# Altium schematic sheet Backup Power.SchDoc
size A; DocumentNumber: 13; SheetNumber: 13; SheetTotal: 16
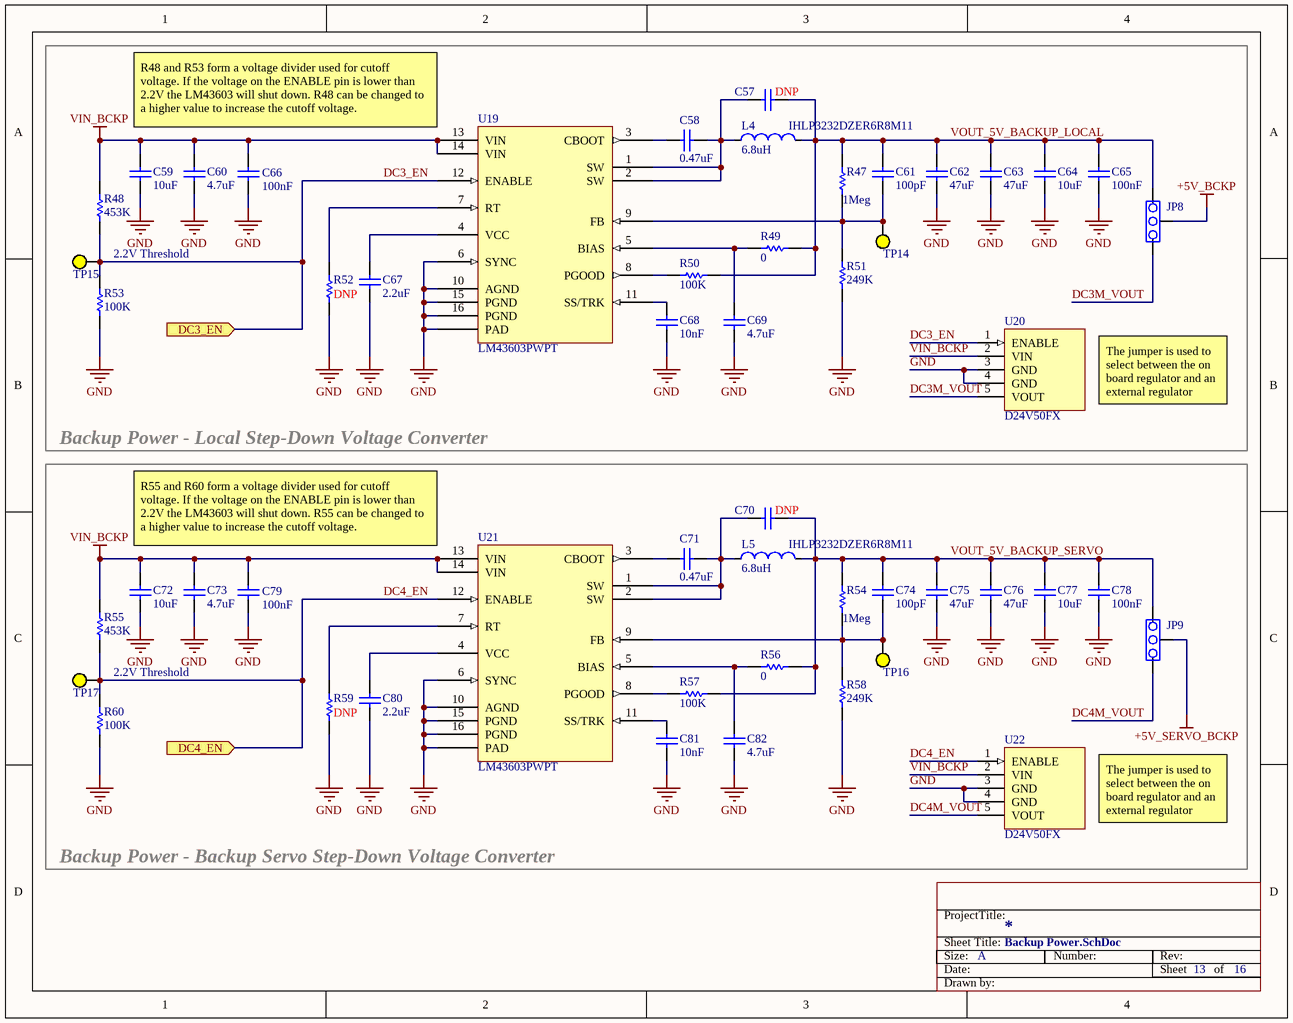
[diagram p0: Backup Power.SchDoc]

## Parts
C57  Note: DNP  [CAP_0402[1005M]]  (hidden comment: Cap)
C58  value 0.47uF  [CAP_0402[1005M]]  (hidden comment: Cap)
C59  value 10uF  [CAP_1210[3225M]]  (hidden comment: Cap)
C60  value 4.7uF  [CAP_1210[3225M]]  (hidden comment: Cap)
C61  value 100pF  [CAP_0402[1005M]]  (hidden comment: Cap)
C62  value 47uF  [CAP_1210[3225M]]  (hidden comment: Cap)
C63  value 47uF  [CAP_1210[3225M]]  (hidden comment: Cap)
C64  value 10uF  [CAP_0805[2012M]]  (hidden comment: Cap)
C65  value 100nF  [CAP_0603[1608M]]  (hidden comment: Cap)
C66  value 100nF  [CAP_0402[1005M]]  (hidden comment: Cap)
C67  value 2.2uF  [CAP_0402[1005M]]  (hidden comment: CAP)
C68  value 10nF  [CAP_0402[1005M]]  (hidden comment: Cap)
C69  value 4.7uF  [CAP_0402[1005M]]  (hidden comment: Cap)
C70  Note: DNP  [CAP_0402[1005M]]  (hidden comment: Cap)
C71  value 0.47uF  [CAP_0402[1005M]]  (hidden comment: Cap)
C72  value 10uF  [CAP_1210[3225M]]  (hidden comment: Cap)
C73  value 4.7uF  [CAP_1210[3225M]]  (hidden comment: Cap)
C74  value 100pF  [CAP_0402[1005M]]  (hidden comment: Cap)
C75  value 47uF  [CAP_1210[3225M]]  (hidden comment: Cap)
C76  value 47uF  [CAP_1210[3225M]]  (hidden comment: Cap)
C77  value 10uF  [CAP_0805[2012M]]  (hidden comment: Cap)
C78  value 100nF  [CAP_0603[1608M]]  (hidden comment: Cap)
C79  value 100nF  [CAP_0402[1005M]]  (hidden comment: Cap)
C80  value 2.2uF  [CAP_0402[1005M]]  (hidden comment: CAP)
C81  value 10nF  [CAP_0402[1005M]]  (hidden comment: Cap)
C82  value 4.7uF  [CAP_0402[1005M]]  (hidden comment: Cap)
JP8  Jumper  [JUMPER_3POS]  (value not drawn)  (no BOM)
JP9  Jumper  [JUMPER_3POS]  (value not drawn)  (no BOM)
L4  6.8uH  Manufacturer Part Number: IHLP3232DZER6R8M11  [IHLP-3232DZ]
L5  6.8uH  Manufacturer Part Number: IHLP3232DZER6R8M11  [IHLP-3232DZ]
R47  value 1Meg  [RES_0402[1005M]]  (hidden comment: RES)
R48  value 453K  [RES_0603[1608M]]  (hidden comment: RES)
R49  value 0  [JUMPER_RES_0402]  (hidden comment: RES)
R50  value 100K  [RES_0402[1005M]]  (hidden comment: RES)
R51  value 249K  [RES_0402[1005M]]  (hidden comment: RES)
R52  Note: DNP  [RES_0402[1005M]]  (hidden comment: RES)
R53  value 100K  [RES_0603[1608M]]  (hidden comment: RES)
R54  value 1Meg  [RES_0402[1005M]]  (hidden comment: RES)
R55  value 453K  [RES_0603[1608M]]  (hidden comment: RES)
R56  value 0  [JUMPER_RES_0402]  (hidden comment: RES)
R57  value 100K  [RES_0402[1005M]]  (hidden comment: RES)
R58  value 249K  [RES_0402[1005M]]  (hidden comment: RES)
R59  Note: DNP  [RES_0402[1005M]]  (hidden comment: RES)
R60  value 100K  [RES_0603[1608M]]  (hidden comment: RES)
TP14  Test Point SIG  [TP_SMD_1_SILK]  (value not drawn)  (no BOM)
TP15  Test Point SIG  [TP_TH_1_SILK]  (value not drawn)  (no BOM)
TP16  Test Point SIG  [TP_SMD_1_SILK]  (value not drawn)  (no BOM)
TP17  Test Point SIG  [TP_TH_1_SILK]  (value not drawn)  (no BOM)
U19  LM43603PWPT  [HTSSOP-16]
U20  Manufacturer Part Number: D24V50FX  [D24V__F_]  (hidden comment: D24V__F_)
U21  LM43603PWPT  [HTSSOP-16]
U22  Manufacturer Part Number: D24V50FX  [D24V__F_]  (hidden comment: D24V__F_)

## Blocks framed on the sheet
Backup Power - Local Step-Down Voltage Converter: C57-C69 JP8 L4 R47-R53 TP14 TP15 U19 U20
Backup Power - Backup Servo Step-Down Voltage Converter: C70-C82 JP9 L5 R54-R60 TP16 TP17 U21 U22

## Ports
DC3_EN (in), DC4_EN (in)

## Nets
+5V_BCKP: JP8.2
+5V_SERVO_BCKP: JP9.2
GND: C59.2 C60.2 C62.2 C63.2 C64.2 C65.2 C66.2 C67.1 C68.2 C69.2 C72.2 C73.2 C75.2 C76.2 C77.2 C78.2 C79.2 C80.1 C81.2 C82.2 R51.2 R52.1 R53.1 R58.2 R59.1 R60.1 U19.6(SYNC) U19.10(AGND) U19.15(PGND) U19.16(PGND) U19.EP(PAD) U20.3(GND) U20.4(GND) U21.6(SYNC) U21.10(AGND) U21.15(PGND) U21.16(PGND) U21.EP(PAD) U22.3(GND) U22.4(GND)
VIN_BCKP: C59.1 C60.1 C66.1 C72.1 C73.1 C79.1 R48.2 R55.2 U19.13(VIN) U19.14(VIN) U20.2(VIN) U21.13(VIN) U21.14(VIN) U22.2(VIN)
DC3_EN: R48.1 R53.2 TP15.1 U19.12(ENABLE) U20.1(ENABLE) ; port DC3_EN
DC3M_VOUT: JP8.3 U20.5(VOUT)
DC4_EN: R55.1 R60.2 TP17.1 U21.12(ENABLE) U22.1(ENABLE) ; port DC4_EN
DC4M_VOUT: JP9.3 U22.5(VOUT)
VOUT_5V_BACKUP_LOCAL: C57.2 C61.1 C62.1 C63.1 C64.1 C65.1 JP8.1 L4.2 R47.1 R49.1 R50.1
VOUT_5V_BACKUP_SERVO: C70.2 C74.1 C75.1 C76.1 C77.1 C78.1 JP9.1 L5.2 R54.1 R56.1 R57.1
NetC57_1: C57.1 C58.2 L4.1 U19.1(SW) U19.2(SW)
NetC58_1: C58.1 U19.3(CBOOT)
NetC61_2: C61.2 R47.2 R51.1 TP14.1 U19.9(FB)
NetC67_2: C67.2 U19.4(VCC)
NetC68_1: C68.1 U19.11(SS/TRK)
NetC69_1: C69.1 R49.2 U19.5(BIAS)
NetC70_1: C70.1 C71.2 L5.1 U21.1(SW) U21.2(SW)
NetC71_1: C71.1 U21.3(CBOOT)
NetC74_2: C74.2 R54.2 R58.1 TP16.1 U21.9(FB)
NetC80_2: C80.2 U21.4(VCC)
NetC81_1: C81.1 U21.11(SS/TRK)
NetC82_1: C82.1 R56.2 U21.5(BIAS)
NetR50_2: R50.2 U19.8(PGOOD)
NetR52_2: R52.2 U19.7(RT)
NetR57_2: R57.2 U21.8(PGOOD)
NetR59_2: R59.2 U21.7(RT)

## Notes on the sheet
- R48 and R53 form a voltage divider used for cutoff voltage. If the voltage on the ENABLE pin is lower than 2.2V the LM43603 will shut down. R48 can be changed to a higher value to increase the cutoff voltage.
- 2.2V Threshold
- The jumper is used to select between the on board regulator and an external regulator
- R55 and R60 form a voltage divider used for cutoff voltage. If the voltage on the ENABLE pin is lower than 2.2V the LM43603 will shut down. R55 can be changed to a higher value to increase the cutoff voltage.
- Sheet Title:
- ProjectTitle:
- Size:
- Date:
- A
- Number:
- Rev:
- Sheet         of
- Drawn by:

## Library data of the parts
C57 C70 = Cap: Capacitor
C58 C71 = Cap: CAP CER 0.1UF 10V 10% X7R 0402; Manufacturer Part Number: CC0402ZRY5V7BB474; Manufacturer: Yageo; Supplier 1: Digi-Key; Supplier Part Number 1: 311-1735-1-ND; ComponentLink1URL: http://www.yageo.com/documents/recent/UPY-GPHC_Y5V_6.3V-to-50V_5_revised.pdf; ComponentLink1Description: Datasheet
C59 C72 = Cap: Capacitor; Manufacturer Part Number: CL32B106KBJNNNE; Manufacturer: Samsung Electro-Mechanics America, Inc.; Supplier 1: Digi-Key; Supplier Part Number 1: 1276-3387-1-ND; ComponentLink1URL: http://www.samsungsem.com/global/support/library/product-catalog/__icsFiles/afieldfile/2014/11/13/MLCC.pdf; ComponentLink1Description: Datasheet
C60 C73 = Cap: Capacitor; Manufacturer Part Number: CL32B475KBUYNNE; Manufacturer: Samsung Electro-Mechanics America, Inc.; Supplier 1: Digi-Key; Supplier Part Number 1: 1276-1292-1-ND; ComponentLink1URL: http://media.digikey.com/pdf/Data%20Sheets/Samsung%20PDFs/CL32B475KBUYNNE_Spec.pdf; ComponentLink1Description: Datasheet
C61 C74 = Cap: CAP CER 0.1UF 10V 10% X7R 0402; Manufacturer: Yageo; Manufacturer Part Number: CC0402JRNPO9BN101; Supplier 1: Digi-Key; Supplier Part Number 1: 311-1024-1-ND; ComponentLink1URL: http://www.yageo.com/documents/recent/UPY-GP_NP0_16V-to-50V_10.pdf; ComponentLink1Description: Datasheet
C62 C63 C75 C76 = Cap: Capacitor; Manufacturer: Murata Electronics North America; Manufacturer Part Number: GRM32ER71A476KE15L; Supplier 1: Digi-Key; Supplier Part Number 1: 490-5312-1-ND; ComponentLink1URL: http://www.murata.com/~/media/webrenewal/support/library/catalog/products/capacitor/mlcc/c02e.ashx; ComponentLink1Description: Datasheet
C64 C77 = Cap: Capacitor; Manufacturer Part Number: CC0805KKX5R7BB106; Manufacturer: Yageo; Supplier 1: Digi-Key; Supplier Part Number 1: 311-1865-1-ND; ComponentLink1URL: http://www.yageo.com/documents/recent/UPY-GPHC_X5R_4V-to-50V_19.pdf; ComponentLink1Description: Datasheet
C65 C78 = Cap: Capacitor; Manufacturer Part Number: CC0603KPX7R7BB104; Manufacturer: Yageo; Supplier 1: Digi-Key; Supplier Part Number 1: 311-1335-1-ND; ComponentLink1URL: http://www.yageo.com/documents/recent/UPY-GPHC_X7R_6.3V-to-50V-v12.pdf; ComponentLink1Description: Datasheet
C66 C79 = Cap: Capacitor; Manufacturer: Yageo; Manufacturer Part Number: CC0402KRX7R6BB104; Supplier 1: Digi-Key; Supplier Part Number 1: 311-1345-1-ND; ComponentLink1URL: http://www.yageo.com/documents/recent/UPY-GPHC_X7R_6.3V-to-50V-v12.pdf; ComponentLink1Description: Datasheet
C67 C80 = CAP: Capacitor; Manufacturer: Yageo; Manufacturer Part Number: CC0402MRX5R5BB225; Supplier 1: Digi-Key; Supplier Part Number 1: 311-1442-1-ND; ComponentLink1URL: http://www.yageo.com/documents/recent/UPY-GPHC_X5R_4V-to-50V_19.pdf; ComponentLink1Description: Datasheet
C68 C81 = Cap: Capacitor; Manufacturer: Yageo; Manufacturer Part Number: CC0402KRX7R7BB103; ComponentLink1URL: http://www.yageo.com/documents/recent/UPY-GPHC_X7R_6.3V-to-50V-v12.pdf; ComponentLink1Description: Datasheet; Supplier 1: Digi-Key; Supplier Part Number 1: 311-1042-1-ND
C69 C82 = Cap: Capacitor; Manufacturer: Yageo; Manufacturer Part Number: CC0402MRX5R6BB475; Supplier 1: Digi-Key; Supplier Part Number 1: 311-1734-1-ND; ComponentLink1URL: http://www.yageo.com/documents/recent/UPY-GPHC_X5R_4V-to-50V_19.pdf; ComponentLink1Description: Datasheet
JP8 JP9 = Jumper_2
L4 L5 = Inductor: FIXED IND 6.8UH 7A 33.4 MOHM SMD; Manufacturer: Vishay Dale; Value: 6.8uH; Supplier 1: Digi-Key; ComponentLink1URL: http://www.vishay.com/docs/34313/ihlp3232dz11.pdf; ComponentLink1Description: Datasheet; Supplier Part Number 1: 541-1355-1-ND
R47 R54 = RES: Resistor; Manufacturer: Rohm Semiconductor; Manufacturer Part Number: MCR01MRTF1004; Supplier 1: Digi-Key; Supplier Part Number 1: RHM1.00MCDCT-ND; ComponentLink1URL: http://rohmfs.rohm.com/en/products/databook/datasheet/passive/resistor/chip_resistor/mcr_g.pdf; ComponentLink1Description: Datasheet
R48 R55 = RES: Resistor; Manufacturer: Yageo; Manufacturer Part Number: RC0603FR-07453KL; ComponentLink1Description: Datasheet; ComponentLink1URL: http://www.yageo.com/NewPortal/yageodocoutput?fileName=/pdf/R-Chip/PYu-RC_Group_51_RoHS_L_3.pdf; Supplier 1: Digi-Key; Supplier Part Number 1: 311-453KHRCT-ND
R49 R56 = RES: Resistor; Manufacturer Part Number: RC0402JR-070RL; Manufacturer: Yageo; Supplier 1: Digi-Key; Supplier Part Number 1: 311-0.0JRCT-ND; ComponentLink1URL: http://www.yageo.com/NewPortal/yageodocoutput?fileName=/pdf/R-Chip/PYu-RC_Group_51_RoHS_L_3.pdf; ComponentLink1Description: Datasheet
R50 R57 = RES: Resistor; Manufacturer: Yageo; Manufacturer Part Number: RC0402FR-07100KL; Supplier 1: Digi-Key; Supplier Part Number 1: 311-100KLRCT-ND; ComponentLink1URL: http://www.yageo.com/NewPortal/yageodocoutput?fileName=/pdf/R-Chip/PYu-RC_Group_51_RoHS_L_3.pdf; ComponentLink1Description: Datasheet
R51 R58 = RES: Resistor; Manufacturer: Rohm Semiconductor; Manufacturer Part Number: MCR01MRTF2493; Supplier 1: Digi-Key; Supplier Part Number 1: RHM249KCDCT-ND; ComponentLink1URL: http://rohmfs.rohm.com/en/products/databook/datasheet/passive/resistor/chip_resistor/mcr_g.pdf; ComponentLink1Description: Datasheet
R52 R59 = RES: Resistor
R53 R60 = RES: Resistor; Manufacturer: Yageo; Manufacturer Part Number: RC0603FR-07100KL; ComponentLink1Description: Datasheet; ComponentLink1URL: http://www.yageo.com/NewPortal/yageodocoutput?fileName=/pdf/R-Chip/PYu-RC_Group_51_RoHS_L_3.pdf; Supplier 1: Digi-Key; Supplier Part Number 1: 311-100KHRCT-ND
TP14-TP17 = Test Point SIG: Test Point Signal
U19 U21 = LM43603PWPT: Simple Switcher 3.5V to 36V 3A Synchronous Step-Down Voltage Converter; Manufacturer: Texas Instruments; Supplier 1: Digi-Key; Supplier Part Number 1: 296-37755-1-ND; ComponentLink1URL: http://www.ti.com/lit/ds/symlink/lm43603.pdf; ComponentLink1Description: Datasheet; Current - Output: 3A; Voltage - Input (Max): 36V; Manufacturer Part Number: LM43603PWPT; Voltage - Input (Min): 3.5V
U20 U22 = D24V__F_: Pololu Buck Converter D24V__F_ series; ComponentLink1Description: Datasheet; ComponentLink1URL: http://www.pololu.com/product/2851; Manufacturer: Pololu; Supplier 1: Pololu; Supplier Part Number 1: D24V50FX